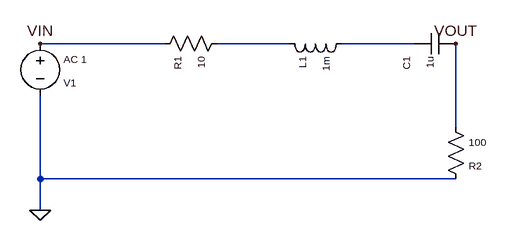
[diagram p0: schematic rlc_series.asc]
rlc_series.asc, the LTspice schematic file:
Version 4
SHEET 1 2120 2120
WIRE 100 228 292 228
WIRE 372 228 484 228
WIRE 564 228 676 228
WIRE 100 308 100 484
WIRE 740 228 740 356
WIRE 740 436 100 436
WIRE 100 436 100 484
FLAG 100 228 VIN
FLAG 740 228 VOUT
SYMBOL voltage 100 212 R0
SYMATTR InstName V1
WINDOW 0 36 76 Left 1
SYMATTR Value AC 1
WINDOW 3 36 40 Left 1
SYMBOL res 388 212 R90
SYMATTR InstName R1
WINDOW 0 36 76 Left 1
SYMATTR Value 10
WINDOW 3 36 40 Left 1
SYMBOL ind 580 212 R90
SYMATTR InstName L1
WINDOW 0 36 76 Left 1
SYMATTR Value 1m
WINDOW 3 36 40 Left 1
SYMBOL cap 740 212 R90
SYMATTR InstName C1
WINDOW 0 36 76 Left 1
SYMATTR Value 1u
WINDOW 3 36 40 Left 1
SYMBOL res 724 340 R0
SYMATTR InstName R2
WINDOW 0 36 76 Left 1
SYMATTR Value 100
WINDOW 3 36 40 Left 1
FLAG 100 484 0

The netlist it stands for:
* rlc_series.asc
V1 VIN 0 AC 1
R1 N001 VIN 10
L1 N002 N001 1m
C1 VOUT N002 1u
R2 VOUT 0 100
.backanno
.end